# EAGLE design Millable AK9750 Human Movement Sensor Breakout (EAGLE 7.7.0)
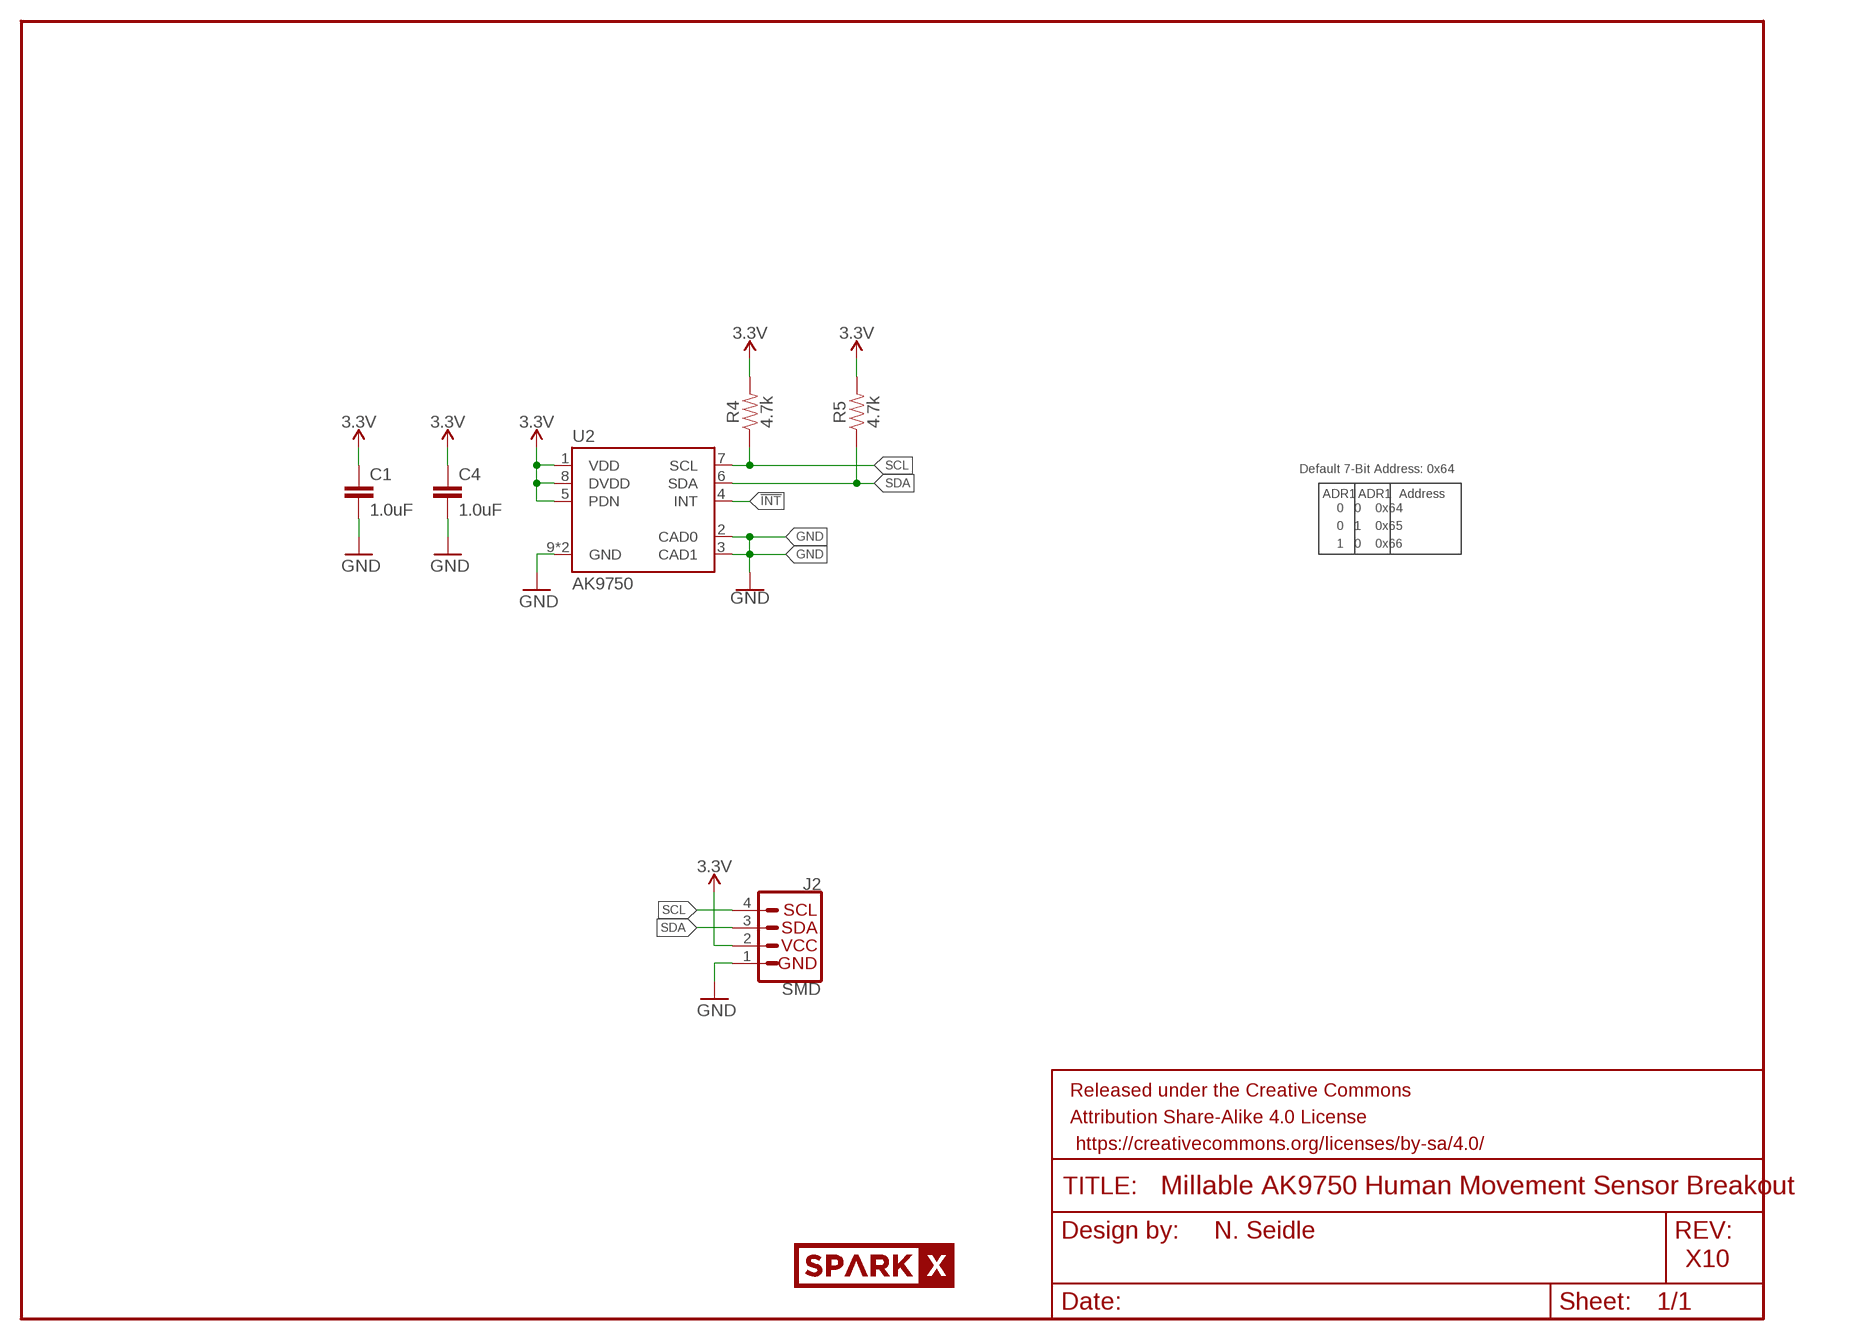
[diagram p0: schematic, sheet 1]

## Parts
C1  1.0uF  1.0UF-0603-16V-10%  [0603]
C4  1.0uF  1.0UF-0603-16V-10%  [0603]
FRAME1  FRAME-LETTER  [CREATIVE_COMMONS]
J2  SMD  I2C_STANDARDJS-1MM  [1X04_1MM_RA]
R4  4.7k  4.7KOHM-0603-1/10W-1%  [0603]
R5  4.7k  4.7KOHM-0603-1/10W-1%  [0603]
U2  AK9750  [SON10]
U$2  SPARKX-LOGO4  [SPARKX-MEDIUM]

## Nets
3.3V: C1.1 C4.1 J2.2(VCC) R4.2 R5.2 U2.1(VDD) U2.5(PDN) U2.8(DVDD)
!INT: U2.4(INT)
GND: C1.2 C4.2 J2.1(GND) U2.2(CAD0) U2.3(CAD1) U2.9(GND) U2.10(GND)
SCL: J2.4(SCL) R4.1 U2.7(SCL)
SDA: J2.3(SDA) R5.1 U2.6(SDA)

## Notes on the sheet
- Default 7-Bit Address: 0x64
- ADR1 | ADR1 | Address
- 0   0    0x64
- 0   1    0x65
- 1   0    0x66
- N. Seidle
- X10

## Library data of the parts
C1 C4 = SparkFun-Capacitors:1.0UF: 1µF ceramic capacitors A capacitor is a passive two-terminal electrical component used to store electrical energy temporarily in an electric field.; PROD_ID: CAP-00868
FRAME1 = SparkFun-Aesthetics:FRAME-LETTER: Schematic Frame - Letter Standard 8.5x11 US Letter frame
J2 = SparkX:I2C_STANDARD: SparkFun I2C Standard Pinout Header SparkFun has standardized on a pinout for all I2C based sensor breakouts. This pinout allows I2C boards to be plugged directly into the headers on Arduino Uno compatible boards, and to be daisy chained easily. Example SparkFun Products: SparkFun Atmospheric Sensor Breakout - BME280 <https://www.sparkfun.com/products/13676> SparkFun Altitude/Pressure Sensor Breakout - MPL3115A2 <https://www.sparkfun.com/products/11084> SparkFun TOF Range Finder Sensor - VL6180 <https://www.sparkfun.com/products/12785>
R4 R5 = SparkFun-Resistors:4.7KOHM: 4.7kΩ resistor A resistor is a passive two-terminal electrical component that implements electrical resistance as a circuit element. Resistors act to reduce current flow, and, at the same time, act to lower voltage levels within circuits. - Wikipedia; PROD_ID: RES-07857
U2 = SparkX:AK9750
U$2 = SparkX:SPARKX-LOGO

## Board
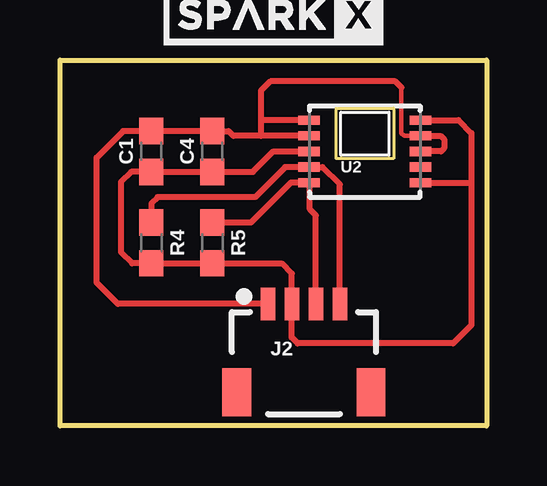
[diagram p1: board, top side]

Size 17.78 x 15.24 mm. Coordinates in mm from the lower left corner, seen from the top.
Outline: 0,0 0,15.24 17.78,15.24 17.78,0 0,0
Copper layers (1*16): Top 0.035mm / dielectric 1.5mm / Bottom 0.035mm
Design rules "SparkFun-2-layer-TIGHT": minimum track width 7mil, minimum drill 15mil, track to track 7mil, track to pad 7mil, pad to pad 7mil, via to via 7mil, smd to smd 7mil, copper to edge 7mil, drill to drill 7mil, minimum pad ring 7mil, minimum via ring 7mil, stop-mask expansion 4mil, vias tented up to drill 25mil, thermal gap 10mil

### Footprints (pad centres in the part's own frame; a part is rotated, then mirrored left to right if it is on the bottom)
0603 = smd 1.1 x 1: 1 -0.85,0; 2 0.85,0
1X04_1MM_RA = smd 0.6 x 1.35: 1 -1.5,0; 2 -0.5,0; 3 0.5,0; 4 1.5,0 | smd 1.2 x 2: NC1 2.8,-3.675; NC2 -2.8,-3.675
SON10 = smd 0.9 x 0.38: 1 2.325,1.3; 2 2.325,0.65; 3 2.325,0; 4 2.325,-0.65; 5 2.325,-1.3; 6 -2.325,-1.3; 7 -2.325,-0.65; 8 -2.325,0; 9 -2.325,0.65; 10 -2.325,1.3

### Placement (x,y rotation side)
C1  3.81,11.43 90 top
C4  6.35,11.43 90 top
FRAME1  -20.32,-17.78 0 top  (outside the outline)
J2  10.16,5.08 0 top
R4  3.81,7.62 270 top
R5  6.35,7.62 270 top
U2  12.7,11.43 0 top
U$2  8.89,17.14 0 top

### Tracks (layer width: path | path; a pad name or v marks a point on that pad's centre or on a via)
3.3V
  Top 0.254: U2.8 8.89,11.43 8.04,10.58 C4.1 C1.1 2.96,10.58 2.54,10.16 2.54,7.24 3.01,6.77 R4.2 R5.2 9.23,6.77 9.66,6.34 J2.2 9.65,3.68 9.91,3.43 16.38,3.43 17.14,4.19 17.14,10.16 | U2.5 17.11,10.13 17.14,10.16 | U2.1 16.61,12.73 17.14,12.19 17.14,10.16
GND
  Top 0.178: U2.2 14.34,12.08 14.22,12.19 14.22,14.1
  Top 0.254: U2.9 8.38,12.08 | 8.38,12.08 7.22,12.08 7.02,12.28 C4.2 C1.2 2.63,12.28 1.52,11.18 1.52,5.97 2.41,5.08 J2.1 | U2.2 15.86,12.08 16,11.94 16,11.56 15.88,11.43 U2.3 | 8.38,12.08 8.38,12.7 | 8.38,12.7 8.38,13.97 8.76,14.35 13.97,14.35 14.22,14.1 | U2.10 8.41,12.73 8.38,12.7
SCL
  Top 0.254: R4.1 3.81,9.27 4.06,9.53 8.13,9.53 9.38,10.78 U2.7 10.94,10.78 11.66,10.06 J2.4
SDA
  Top 0.254: R5.1 7.96,8.47 9.62,10.13 U2.6 10.41,10.09 10.41,9.02 10.66,8.77 J2.3

### Text on the board
tPlace: AK9750 / Presence Sensor